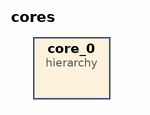
[diagram p0: block diagram of the top level]
# Vivado block design cores, xck26-sfvc784-2LV-c, Vivado 2025.2
create_bd_design cores

create_bd_cell -type hier core_0

# ---- hierarchy /core_0 ----
current_bd_instance /core_0
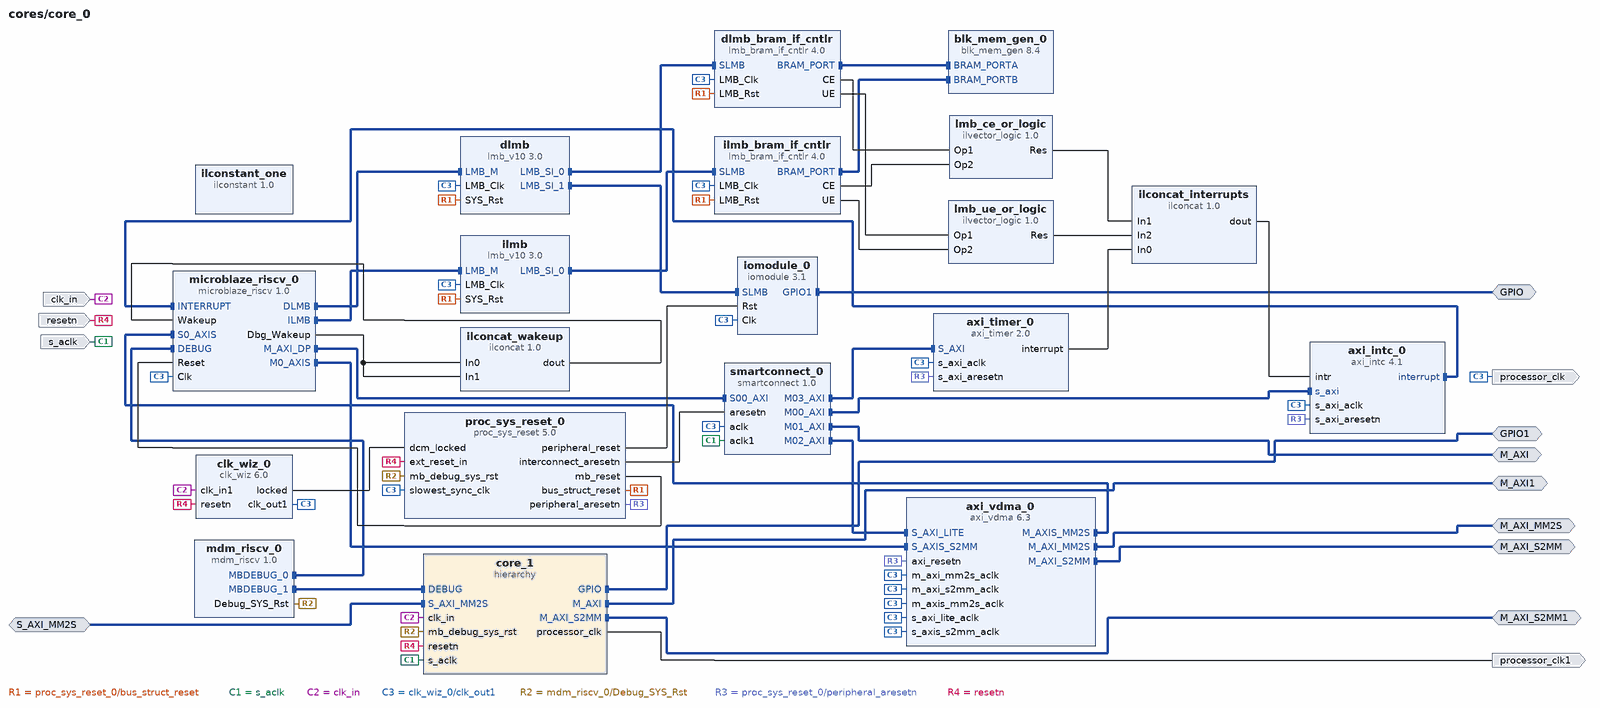
[diagram p1: block diagram inside /core_0]
create_bd_intf_pin -mode Master -vlnv xilinx.com:interface:aximm_rtl:1.0 M_AXI_S2MM
create_bd_intf_pin -mode Master -vlnv xilinx.com:interface:gpio_rtl:1.0 GPIO
create_bd_intf_pin -mode Master -vlnv xilinx.com:interface:aximm_rtl:1.0 M_AXI
create_bd_intf_pin -mode Master -vlnv xilinx.com:interface:aximm_rtl:1.0 M_AXI_MM2S
create_bd_intf_pin -mode Master -vlnv xilinx.com:interface:gpio_rtl:1.0 GPIO1
create_bd_intf_pin -mode Master -vlnv xilinx.com:interface:aximm_rtl:1.0 M_AXI1
create_bd_intf_pin -mode Slave -vlnv xilinx.com:interface:aximm_rtl:1.0 S_AXI_MM2S
create_bd_intf_pin -mode Master -vlnv xilinx.com:interface:aximm_rtl:1.0 M_AXI_S2MM1
create_bd_pin -dir I -type rst resetn
create_bd_pin -dir I -type clk clk_in
create_bd_pin -dir I -type clk s_aclk
create_bd_pin -dir O processor_clk
create_bd_pin -dir O processor_clk1

create_bd_cell -type ip -vlnv xilinx.com:ip:microblaze_riscv:1.0 microblaze_riscv_0
set_property -dict [list \
  CONFIG.C_BRANCH_TARGET_CACHE_SIZE 0 \
  CONFIG.C_DATA_SIZE 32 \
  CONFIG.C_DEBUG_EVENT_COUNTERS 2 \
  CONFIG.C_DEBUG_INTERFACE 0 \
  CONFIG.C_DEBUG_LATENCY_COUNTERS 2 \
  CONFIG.C_D_AXI 1 \
  CONFIG.C_ENABLE_DISCRETE_PORTS 1 \
  CONFIG.C_FSL_EXCEPTION 0 \
  CONFIG.C_FSL_LINKS 1 \
  CONFIG.C_ILL_INSTR_EXCEPTION 1 \
  CONFIG.C_I_AXI 0 \
  CONFIG.C_LOCKSTEP_SELECT 0 \
  CONFIG.C_MISALIGNED_EXCEPTIONS 0 \
  CONFIG.C_NUMBER_OF_PC_BRK 2 \
  CONFIG.C_NUMBER_OF_RD_ADDR_BRK 2 \
  CONFIG.C_NUMBER_OF_WR_ADDR_BRK 2 \
  CONFIG.C_OPTIMIZATION 0 \
  CONFIG.C_PMP_ENTRIES 0 \
  CONFIG.C_PMP_GRANULARITY 0 \
  CONFIG.C_TRACE 0 \
  CONFIG.C_USE_ATOMIC 0 \
  CONFIG.C_USE_BARREL 1 \
  CONFIG.C_USE_BITMAN_A 1 \
  CONFIG.C_USE_BITMAN_B 1 \
  CONFIG.C_USE_BITMAN_C 1 \
  CONFIG.C_USE_BITMAN_S 1 \
  CONFIG.C_USE_BRANCH_TARGET_CACHE 0 \
  CONFIG.C_USE_COMPRESSION 0 \
  CONFIG.C_USE_DCACHE 0 \
  CONFIG.C_USE_EXTENDED_FSL_INSTR 1 \
  CONFIG.C_USE_ICACHE 0 \
  CONFIG.C_USE_INTERRUPT 1 \
  CONFIG.C_USE_MMU 0 \
  CONFIG.C_USE_MULDIV 0 \
  CONFIG.G_TEMPLATE_LIST 4 \
] [get_bd_cells microblaze_riscv_0]
create_bd_cell -type ip -vlnv xilinx.com:ip:clk_wiz:6.0 clk_wiz_0
set_property -dict [list \
  CONFIG.CLKOUT1_DRIVES Buffer \
  CONFIG.CLKOUT1_JITTER 125.050 \
  CONFIG.CLKOUT1_MATCHED_ROUTING true \
  CONFIG.CLKOUT1_PHASE_ERROR 114.212 \
  CONFIG.CLKOUT1_REQUESTED_OUT_FREQ 200.000 \
  CONFIG.CLKOUT2_DRIVES Buffer \
  CONFIG.CLKOUT2_JITTER 142.903 \
  CONFIG.CLKOUT2_MATCHED_ROUTING true \
  CONFIG.CLKOUT2_PHASE_ERROR 114.212 \
  CONFIG.CLKOUT2_USED true \
  CONFIG.CLKOUT3_DRIVES Buffer \
  CONFIG.CLKOUT4_DRIVES Buffer \
  CONFIG.CLKOUT5_DRIVES Buffer \
  CONFIG.CLKOUT6_DRIVES Buffer \
  CONFIG.CLKOUT7_DRIVES Buffer \
  CONFIG.MMCM_BANDWIDTH OPTIMIZED \
  CONFIG.MMCM_CLKFBOUT_MULT_F 8 \
  CONFIG.MMCM_CLKOUT0_DIVIDE_F 4 \
  CONFIG.MMCM_CLKOUT1_DIVIDE 8 \
  CONFIG.MMCM_COMPENSATION AUTO \
  CONFIG.NUM_OUT_CLKS 2 \
  CONFIG.OPTIMIZE_CLOCKING_STRUCTURE_EN true \
  CONFIG.PRIMITIVE PLL \
  CONFIG.PRIM_SOURCE Global_buffer \
  CONFIG.RESET_PORT resetn \
  CONFIG.RESET_TYPE ACTIVE_LOW \
] [get_bd_cells clk_wiz_0]
create_bd_cell -type ip -vlnv xilinx.com:ip:proc_sys_reset:5.0 proc_sys_reset_0
create_bd_cell -type ip -vlnv xilinx.com:ip:axi_intc:4.1 axi_intc_0
set_property -dict [list \
  CONFIG.C_HAS_FAST 0 \
  CONFIG.C_PROCESSOR_CLK_FREQ_MHZ 200.0 \
  CONFIG.C_S_AXI_ACLK_FREQ_MHZ 200.0 \
] [get_bd_cells axi_intc_0]
create_bd_cell -type inline_hdl -vlnv xilinx.com:inline_hdl:ilconcat:1.0 ilconcat_wakeup
set_property -dict {CONFIG.NUM_PORTS 2} [get_bd_cells ilconcat_wakeup]
create_bd_cell -type ip -vlnv xilinx.com:ip:smartconnect:1.0 smartconnect_0
set_property -dict {CONFIG.NUM_CLKS 2 CONFIG.NUM_MI 4 CONFIG.NUM_SI 1} [get_bd_cells smartconnect_0]
create_bd_cell -type ip -vlnv xilinx.com:ip:lmb_v10:3.0 dlmb
set_property -dict {CONFIG.C_LMB_NUM_SLAVES 2} [get_bd_cells dlmb]
create_bd_cell -type ip -vlnv xilinx.com:ip:lmb_v10:3.0 ilmb
create_bd_cell -type ip -vlnv xilinx.com:ip:lmb_bram_if_cntlr:4.0 dlmb_bram_if_cntlr
set_property -dict {CONFIG.C_ECC 1} [get_bd_cells dlmb_bram_if_cntlr]
create_bd_cell -type ip -vlnv xilinx.com:ip:lmb_bram_if_cntlr:4.0 ilmb_bram_if_cntlr
set_property -dict {CONFIG.C_ECC 1} [get_bd_cells ilmb_bram_if_cntlr]
create_bd_cell -type ip -vlnv xilinx.com:ip:iomodule:3.1 iomodule_0
set_property -dict {CONFIG.C_GPO1_SIZE 2 CONFIG.C_USE_GPO1 1} [get_bd_cells iomodule_0]
create_bd_cell -type ip -vlnv xilinx.com:ip:blk_mem_gen:8.4 blk_mem_gen_0
set_property -dict [list \
  CONFIG.Assume_Synchronous_Clk true \
  CONFIG.Memory_Type True_Dual_Port_RAM \
  CONFIG.PRIM_type_to_Implement BRAM \
] [get_bd_cells blk_mem_gen_0]
create_bd_cell -type inline_hdl -vlnv xilinx.com:inline_hdl:ilvector_logic:1.0 lmb_ce_or_logic
set_property -dict {CONFIG.C_OPERATION or CONFIG.C_SIZE 1} [get_bd_cells lmb_ce_or_logic]
create_bd_cell -type inline_hdl -vlnv xilinx.com:inline_hdl:ilvector_logic:1.0 lmb_ue_or_logic
set_property -dict {CONFIG.C_OPERATION or CONFIG.C_SIZE 1} [get_bd_cells lmb_ue_or_logic]
create_bd_cell -type inline_hdl -vlnv xilinx.com:inline_hdl:ilconcat:1.0 ilconcat_interrupts
set_property -dict {CONFIG.NUM_PORTS 3} [get_bd_cells ilconcat_interrupts]
create_bd_cell -type ip -vlnv xilinx.com:ip:axi_vdma:6.3 axi_vdma_0
set_property -dict [list \
  CONFIG.c_enable_vert_flip 0 \
  CONFIG.c_include_mm2s 1 \
  CONFIG.c_include_s2mm 1 \
  CONFIG.c_m_axi_mm2s_data_width 1024 \
  CONFIG.c_m_axi_s2mm_data_width 1024 \
  CONFIG.c_m_axis_mm2s_tdata_width 32 \
  CONFIG.c_mm2s_linebuffer_depth 1024 \
  CONFIG.c_num_fstores 1 \
  CONFIG.c_s2mm_linebuffer_depth 1024 \
  CONFIG.c_s2mm_max_burst_length 2 \
  CONFIG.c_use_mm2s_fsync 0 \
] [get_bd_cells axi_vdma_0]
create_bd_cell -type ip -vlnv xilinx.com:ip:axi_timer:2.0 axi_timer_0
create_bd_cell -type hier core_1
create_bd_cell -type inline_hdl -vlnv xilinx.com:inline_hdl:ilconstant:1.0 ilconstant_one
create_bd_cell -type ip -vlnv xilinx.com:ip:mdm_riscv:1.0 mdm_riscv_0
set_property -dict {CONFIG.C_MB_DBG_PORTS 2} [get_bd_cells mdm_riscv_0]

# ---- hierarchy /core_0/core_1 ----
current_bd_instance /core_0/core_1
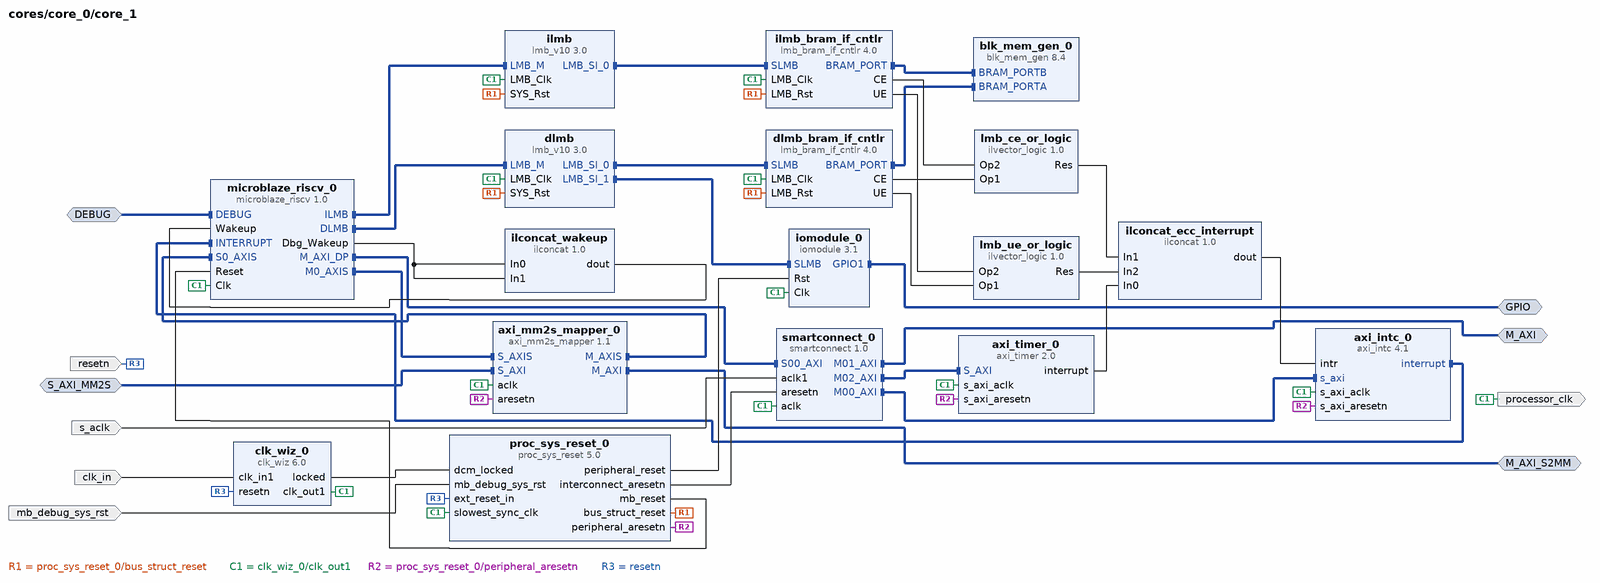
[diagram p2: block diagram inside /core_0/core_1]
create_bd_intf_pin -mode Slave -vlnv xilinx.com:interface:mbdebug_rtl:3.0 DEBUG
create_bd_intf_pin -mode Slave -vlnv xilinx.com:interface:aximm_rtl:1.0 S_AXI_MM2S
create_bd_intf_pin -mode Master -vlnv xilinx.com:interface:aximm_rtl:1.0 M_AXI_S2MM
create_bd_intf_pin -mode Master -vlnv xilinx.com:interface:gpio_rtl:1.0 GPIO
create_bd_intf_pin -mode Master -vlnv xilinx.com:interface:aximm_rtl:1.0 M_AXI
create_bd_pin -dir I -type rst resetn
create_bd_pin -dir I -type clk clk_in
create_bd_pin -dir I -type rst mb_debug_sys_rst
create_bd_pin -dir I -type clk s_aclk
create_bd_pin -dir O processor_clk

create_bd_cell -type ip -vlnv xilinx.com:ip:microblaze_riscv:1.0 microblaze_riscv_0
set_property -dict [list \
  CONFIG.C_BRANCH_TARGET_CACHE_SIZE 0 \
  CONFIG.C_DEBUG_EVENT_COUNTERS 2 \
  CONFIG.C_DEBUG_EXTERNAL_TRACE 0 \
  CONFIG.C_DEBUG_LATENCY_COUNTERS 2 \
  CONFIG.C_DP_AXI_MON 0 \
  CONFIG.C_D_AXI 1 \
  CONFIG.C_D_LMB_MON 0 \
  CONFIG.C_ENABLE_DISCRETE_PORTS 1 \
  CONFIG.C_FSL_LINKS 1 \
  CONFIG.C_HARTID 0x0000000000000001 \
  CONFIG.C_ILL_INSTR_EXCEPTION 1 \
  CONFIG.C_INTERRUPT_MON 1 \
  CONFIG.C_I_AXI 0 \
  CONFIG.C_I_LMB_MON 0 \
  CONFIG.C_LOCKSTEP_SELECT 0 \
  CONFIG.C_MISALIGNED_EXCEPTIONS 0 \
  CONFIG.C_NUMBER_OF_PC_BRK 2 \
  CONFIG.C_NUMBER_OF_RD_ADDR_BRK 2 \
  CONFIG.C_NUMBER_OF_WR_ADDR_BRK 2 \
  CONFIG.C_PMP_ENTRIES 0 \
  CONFIG.C_PMP_GRANULARITY 0 \
  CONFIG.C_TRACE 0 \
  CONFIG.C_USE_ATOMIC 0 \
  CONFIG.C_USE_BARREL 1 \
  CONFIG.C_USE_BITMAN_A 1 \
  CONFIG.C_USE_BITMAN_B 1 \
  CONFIG.C_USE_BITMAN_C 1 \
  CONFIG.C_USE_BITMAN_S 1 \
  CONFIG.C_USE_BRANCH_TARGET_CACHE 0 \
  CONFIG.C_USE_COMPRESSION 0 \
  CONFIG.C_USE_INTERRUPT 1 \
  CONFIG.C_USE_MULDIV 0 \
  CONFIG.G_TEMPLATE_LIST 4 \
] [get_bd_cells microblaze_riscv_0]
create_bd_cell -type ip -vlnv xilinx.com:ip:clk_wiz:6.0 clk_wiz_0
set_property -dict [list \
  CONFIG.CLKOUT1_DRIVES Buffer \
  CONFIG.CLKOUT1_JITTER 125.050 \
  CONFIG.CLKOUT1_PHASE_ERROR 114.212 \
  CONFIG.CLKOUT1_REQUESTED_OUT_FREQ 200.000 \
  CONFIG.CLKOUT2_DRIVES Buffer \
  CONFIG.CLKOUT3_DRIVES Buffer \
  CONFIG.CLKOUT4_DRIVES Buffer \
  CONFIG.CLKOUT5_DRIVES Buffer \
  CONFIG.CLKOUT6_DRIVES Buffer \
  CONFIG.CLKOUT7_DRIVES Buffer \
  CONFIG.MMCM_BANDWIDTH OPTIMIZED \
  CONFIG.MMCM_CLKFBOUT_MULT_F 8 \
  CONFIG.MMCM_CLKOUT0_DIVIDE_F 4 \
  CONFIG.MMCM_COMPENSATION AUTO \
  CONFIG.OPTIMIZE_CLOCKING_STRUCTURE_EN true \
  CONFIG.PRIMITIVE PLL \
  CONFIG.PRIM_SOURCE Global_buffer \
  CONFIG.RESET_PORT resetn \
  CONFIG.RESET_TYPE ACTIVE_LOW \
] [get_bd_cells clk_wiz_0]
create_bd_cell -type ip -vlnv xilinx.com:ip:proc_sys_reset:5.0 proc_sys_reset_0
create_bd_cell -type ip -vlnv xilinx.com:ip:axi_intc:4.1 axi_intc_0
set_property -dict [list \
  CONFIG.C_HAS_FAST 0 \
  CONFIG.C_PROCESSOR_CLK_FREQ_MHZ 200.0 \
  CONFIG.C_S_AXI_ACLK_FREQ_MHZ 200.0 \
] [get_bd_cells axi_intc_0]
create_bd_cell -type inline_hdl -vlnv xilinx.com:inline_hdl:ilconcat:1.0 ilconcat_wakeup
create_bd_cell -type ip -vlnv xilinx.com:ip:axi_mm2s_mapper:1.1 axi_mm2s_mapper_0
set_property -dict {CONFIG.DATA_WIDTH 1024 CONFIG.TDATA_NUM_BYTES 4} [get_bd_cells axi_mm2s_mapper_0]
create_bd_cell -type ip -vlnv xilinx.com:ip:smartconnect:1.0 smartconnect_0
set_property -dict {CONFIG.NUM_CLKS 2 CONFIG.NUM_MI 3 CONFIG.NUM_SI 1} [get_bd_cells smartconnect_0]
create_bd_cell -type ip -vlnv xilinx.com:ip:lmb_v10:3.0 dlmb
set_property -dict {CONFIG.C_LMB_NUM_SLAVES 2} [get_bd_cells dlmb]
create_bd_cell -type ip -vlnv xilinx.com:ip:lmb_bram_if_cntlr:4.0 ilmb_bram_if_cntlr
set_property -dict {CONFIG.C_ECC 1} [get_bd_cells ilmb_bram_if_cntlr]
create_bd_cell -type ip -vlnv xilinx.com:ip:iomodule:3.1 iomodule_0
set_property -dict {CONFIG.C_GPO1_SIZE 2 CONFIG.C_USE_GPO1 1} [get_bd_cells iomodule_0]
create_bd_cell -type ip -vlnv xilinx.com:ip:blk_mem_gen:8.4 blk_mem_gen_0
set_property -dict [list \
  CONFIG.Assume_Synchronous_Clk true \
  CONFIG.Memory_Type True_Dual_Port_RAM \
  CONFIG.PRIM_type_to_Implement BRAM \
] [get_bd_cells blk_mem_gen_0]
create_bd_cell -type inline_hdl -vlnv xilinx.com:inline_hdl:ilvector_logic:1.0 lmb_ce_or_logic
set_property -dict {CONFIG.C_OPERATION or CONFIG.C_SIZE 1} [get_bd_cells lmb_ce_or_logic]
create_bd_cell -type inline_hdl -vlnv xilinx.com:inline_hdl:ilvector_logic:1.0 lmb_ue_or_logic
set_property -dict {CONFIG.C_OPERATION or CONFIG.C_SIZE 1} [get_bd_cells lmb_ue_or_logic]
create_bd_cell -type inline_hdl -vlnv xilinx.com:inline_hdl:ilconcat:1.0 ilconcat_ecc_interrupt
set_property -dict {CONFIG.NUM_PORTS 3} [get_bd_cells ilconcat_ecc_interrupt]
create_bd_cell -type ip -vlnv xilinx.com:ip:axi_timer:2.0 axi_timer_0
create_bd_cell -type ip -vlnv xilinx.com:ip:lmb_v10:3.0 ilmb
create_bd_cell -type ip -vlnv xilinx.com:ip:lmb_bram_if_cntlr:4.0 dlmb_bram_if_cntlr
set_property -dict {CONFIG.C_ECC 1} [get_bd_cells dlmb_bram_if_cntlr]

# ---- connections ----

current_bd_instance /core_0
connect_bd_intf_net [get_bd_intf_pins dlmb_bram_if_cntlr/SLMB] [get_bd_intf_pins dlmb/LMB_Sl_0]
connect_bd_intf_net [get_bd_intf_pins core_1/GPIO] [get_bd_intf_pins GPIO1]
connect_bd_intf_net [get_bd_intf_pins ilmb_bram_if_cntlr/SLMB] [get_bd_intf_pins ilmb/LMB_Sl_0]
connect_bd_intf_net [get_bd_intf_pins iomodule_0/SLMB] [get_bd_intf_pins dlmb/LMB_Sl_1]
connect_bd_intf_net [get_bd_intf_pins iomodule_0/GPIO1] [get_bd_intf_pins GPIO]
connect_bd_intf_net [get_bd_intf_pins smartconnect_0/M01_AXI] [get_bd_intf_pins M_AXI]
connect_bd_intf_net [get_bd_intf_pins core_1/M_AXI] [get_bd_intf_pins M_AXI1]
connect_bd_intf_net [get_bd_intf_pins core_1/S_AXI_MM2S] [get_bd_intf_pins S_AXI_MM2S]
connect_bd_intf_net [get_bd_intf_pins core_1/M_AXI_S2MM] [get_bd_intf_pins M_AXI_S2MM1]
connect_bd_intf_net [get_bd_intf_pins core_1/DEBUG] [get_bd_intf_pins mdm_riscv_0/MBDEBUG_1]
connect_bd_intf_net [get_bd_intf_pins axi_intc_0/interrupt] [get_bd_intf_pins microblaze_riscv_0/INTERRUPT]
connect_bd_intf_net [get_bd_intf_pins axi_vdma_0/M_AXIS_MM2S] [get_bd_intf_pins microblaze_riscv_0/S0_AXIS]
connect_bd_intf_net [get_bd_intf_pins M_AXI_MM2S] [get_bd_intf_pins axi_vdma_0/M_AXI_MM2S]
connect_bd_intf_net [get_bd_intf_pins M_AXI_S2MM] [get_bd_intf_pins axi_vdma_0/M_AXI_S2MM]
connect_bd_intf_net [get_bd_intf_pins blk_mem_gen_0/BRAM_PORTA] [get_bd_intf_pins dlmb_bram_if_cntlr/BRAM_PORT]
connect_bd_intf_net [get_bd_intf_pins blk_mem_gen_0/BRAM_PORTB] [get_bd_intf_pins ilmb_bram_if_cntlr/BRAM_PORT]
connect_bd_intf_net [get_bd_intf_pins microblaze_riscv_0/DEBUG] [get_bd_intf_pins mdm_riscv_0/MBDEBUG_0]
connect_bd_intf_net [get_bd_intf_pins dlmb/LMB_M] [get_bd_intf_pins microblaze_riscv_0/DLMB]
connect_bd_intf_net [get_bd_intf_pins ilmb/LMB_M] [get_bd_intf_pins microblaze_riscv_0/ILMB]
connect_bd_intf_net [get_bd_intf_pins axi_vdma_0/S_AXIS_S2MM] [get_bd_intf_pins microblaze_riscv_0/M0_AXIS]
connect_bd_intf_net [get_bd_intf_pins smartconnect_0/S00_AXI] [get_bd_intf_pins microblaze_riscv_0/M_AXI_DP]
connect_bd_intf_net [get_bd_intf_pins smartconnect_0/M00_AXI] [get_bd_intf_pins axi_intc_0/s_axi]
connect_bd_intf_net [get_bd_intf_pins smartconnect_0/M02_AXI] [get_bd_intf_pins axi_vdma_0/S_AXI_LITE]
connect_bd_intf_net [get_bd_intf_pins axi_timer_0/S_AXI] [get_bd_intf_pins smartconnect_0/M03_AXI]
connect_bd_net [get_bd_pins microblaze_riscv_0/Dbg_Wakeup] [get_bd_pins ilconcat_wakeup/In0] [get_bd_pins ilconcat_wakeup/In1]
connect_bd_net [get_bd_pins proc_sys_reset_0/bus_struct_reset] \
  [get_bd_pins ilmb/SYS_Rst] [get_bd_pins dlmb/SYS_Rst] [get_bd_pins dlmb_bram_if_cntlr/LMB_Rst] \
  [get_bd_pins ilmb_bram_if_cntlr/LMB_Rst]
connect_bd_net -net aclk1_0_1 [get_bd_pins s_aclk] [get_bd_pins smartconnect_0/aclk1] [get_bd_pins core_1/s_aclk]
connect_bd_net [get_bd_pins axi_timer_0/interrupt] [get_bd_pins ilconcat_interrupts/In0]
connect_bd_net -net clk_in1_0_1 [get_bd_pins clk_in] [get_bd_pins clk_wiz_0/clk_in1] [get_bd_pins core_1/clk_in]
connect_bd_net [get_bd_pins clk_wiz_0/clk_out1] \
  [get_bd_pins microblaze_riscv_0/Clk] [get_bd_pins proc_sys_reset_0/slowest_sync_clk] [get_bd_pins axi_intc_0/s_axi_aclk] \
  [get_bd_pins smartconnect_0/aclk] [get_bd_pins ilmb/LMB_Clk] [get_bd_pins dlmb/LMB_Clk] \
  [get_bd_pins dlmb_bram_if_cntlr/LMB_Clk] [get_bd_pins ilmb_bram_if_cntlr/LMB_Clk] [get_bd_pins iomodule_0/Clk] \
  [get_bd_pins processor_clk] [get_bd_pins axi_vdma_0/s_axi_lite_aclk] [get_bd_pins axi_vdma_0/m_axi_mm2s_aclk] \
  [get_bd_pins axi_vdma_0/m_axis_mm2s_aclk] [get_bd_pins axi_vdma_0/m_axi_s2mm_aclk] \
  [get_bd_pins axi_vdma_0/s_axis_s2mm_aclk] [get_bd_pins axi_timer_0/s_axi_aclk]
connect_bd_net [get_bd_pins clk_wiz_0/locked] [get_bd_pins proc_sys_reset_0/dcm_locked]
connect_bd_net [get_bd_pins core_1/processor_clk] [get_bd_pins processor_clk1]
connect_bd_net [get_bd_pins dlmb_bram_if_cntlr/CE] [get_bd_pins lmb_ce_or_logic/Op1]
connect_bd_net [get_bd_pins dlmb_bram_if_cntlr/UE] [get_bd_pins lmb_ue_or_logic/Op1]
connect_bd_net -net ilconcat_0_dout [get_bd_pins ilconcat_wakeup/dout] [get_bd_pins microblaze_riscv_0/Wakeup]
connect_bd_net -net ilconcat_ecc_interrupt_dout [get_bd_pins ilconcat_interrupts/dout] [get_bd_pins axi_intc_0/intr]
connect_bd_net [get_bd_pins ilmb_bram_if_cntlr/CE] [get_bd_pins lmb_ce_or_logic/Op2]
connect_bd_net [get_bd_pins ilmb_bram_if_cntlr/UE] [get_bd_pins lmb_ue_or_logic/Op2]
connect_bd_net [get_bd_pins lmb_ce_or_logic/Res] [get_bd_pins ilconcat_interrupts/In1]
connect_bd_net [get_bd_pins lmb_ue_or_logic/Res] [get_bd_pins ilconcat_interrupts/In2]
connect_bd_net -net mb_debug_sys_rst_0_1 [get_bd_pins mdm_riscv_0/Debug_SYS_Rst] \
  [get_bd_pins proc_sys_reset_0/mb_debug_sys_rst] [get_bd_pins core_1/mb_debug_sys_rst]
connect_bd_net [get_bd_pins proc_sys_reset_0/interconnect_aresetn] [get_bd_pins smartconnect_0/aresetn]
connect_bd_net [get_bd_pins proc_sys_reset_0/mb_reset] [get_bd_pins microblaze_riscv_0/Reset]
connect_bd_net [get_bd_pins proc_sys_reset_0/peripheral_aresetn] \
  [get_bd_pins axi_intc_0/s_axi_aresetn] [get_bd_pins axi_vdma_0/axi_resetn] [get_bd_pins axi_timer_0/s_axi_aresetn]
connect_bd_net [get_bd_pins proc_sys_reset_0/peripheral_reset] [get_bd_pins iomodule_0/Rst]
connect_bd_net -net resetn_0_1 [get_bd_pins resetn] \
  [get_bd_pins clk_wiz_0/resetn] [get_bd_pins proc_sys_reset_0/ext_reset_in] [get_bd_pins core_1/resetn]
set_property HDL_ATTRIBUTE.BMM_INFO_PROCESSOR {riscv > design_top core_0/dlmb_bram_if_cntlr} [get_bd_cells microblaze_riscv_0]
set_property HDL_ATTRIBUTE.KEEP_HIERARCHY yes [get_bd_cells microblaze_riscv_0]
set_property HDL_ATTRIBUTE.BMM_INFO_ADDRESS_SPACE {byte  0xF4000000 40 > design_top core_0/blk_mem_gen_0} [get_bd_cells dlmb_bram_if_cntlr]
set_property HDL_ATTRIBUTE.KEEP_HIERARCHY yes [get_bd_cells dlmb_bram_if_cntlr]

current_bd_instance /core_0/core_1
connect_bd_intf_net [get_bd_intf_pins dlmb/LMB_Sl_0] [get_bd_intf_pins dlmb_bram_if_cntlr/SLMB]
connect_bd_intf_net [get_bd_intf_pins axi_mm2s_mapper_0/S_AXI] [get_bd_intf_pins S_AXI_MM2S]
connect_bd_intf_net [get_bd_intf_pins axi_mm2s_mapper_0/M_AXI] [get_bd_intf_pins M_AXI_S2MM]
connect_bd_intf_net [get_bd_intf_pins ilmb_bram_if_cntlr/SLMB] [get_bd_intf_pins ilmb/LMB_Sl_0]
connect_bd_intf_net [get_bd_intf_pins iomodule_0/SLMB] [get_bd_intf_pins dlmb/LMB_Sl_1]
connect_bd_intf_net [get_bd_intf_pins iomodule_0/GPIO1] [get_bd_intf_pins GPIO]
connect_bd_intf_net [get_bd_intf_pins smartconnect_0/M01_AXI] [get_bd_intf_pins M_AXI]
connect_bd_intf_net [get_bd_intf_pins DEBUG] [get_bd_intf_pins microblaze_riscv_0/DEBUG]
connect_bd_intf_net [get_bd_intf_pins axi_intc_0/interrupt] [get_bd_intf_pins microblaze_riscv_0/INTERRUPT]
connect_bd_intf_net [get_bd_intf_pins microblaze_riscv_0/S0_AXIS] [get_bd_intf_pins axi_mm2s_mapper_0/M_AXIS]
connect_bd_intf_net [get_bd_intf_pins blk_mem_gen_0/BRAM_PORTA] [get_bd_intf_pins dlmb_bram_if_cntlr/BRAM_PORT]
connect_bd_intf_net [get_bd_intf_pins blk_mem_gen_0/BRAM_PORTB] [get_bd_intf_pins ilmb_bram_if_cntlr/BRAM_PORT]
connect_bd_intf_net [get_bd_intf_pins dlmb/LMB_M] [get_bd_intf_pins microblaze_riscv_0/DLMB]
connect_bd_intf_net [get_bd_intf_pins microblaze_riscv_0/ILMB] [get_bd_intf_pins ilmb/LMB_M]
connect_bd_intf_net [get_bd_intf_pins microblaze_riscv_0/M0_AXIS] [get_bd_intf_pins axi_mm2s_mapper_0/S_AXIS]
connect_bd_intf_net [get_bd_intf_pins microblaze_riscv_0/M_AXI_DP] [get_bd_intf_pins smartconnect_0/S00_AXI]
connect_bd_intf_net [get_bd_intf_pins smartconnect_0/M00_AXI] [get_bd_intf_pins axi_intc_0/s_axi]
connect_bd_intf_net [get_bd_intf_pins smartconnect_0/M02_AXI] [get_bd_intf_pins axi_timer_0/S_AXI]
connect_bd_net [get_bd_pins microblaze_riscv_0/Dbg_Wakeup] [get_bd_pins ilconcat_wakeup/In0] [get_bd_pins ilconcat_wakeup/In1]
connect_bd_net [get_bd_pins proc_sys_reset_0/bus_struct_reset] \
  [get_bd_pins dlmb/SYS_Rst] [get_bd_pins ilmb_bram_if_cntlr/LMB_Rst] [get_bd_pins ilmb/SYS_Rst] \
  [get_bd_pins dlmb_bram_if_cntlr/LMB_Rst]
connect_bd_net -net aclk1_0_1 [get_bd_pins s_aclk] [get_bd_pins smartconnect_0/aclk1]
connect_bd_net [get_bd_pins axi_timer_0/interrupt] [get_bd_pins ilconcat_ecc_interrupt/In0]
connect_bd_net -net clk_in1_0_1 [get_bd_pins clk_in] [get_bd_pins clk_wiz_0/clk_in1]
connect_bd_net [get_bd_pins clk_wiz_0/clk_out1] \
  [get_bd_pins microblaze_riscv_0/Clk] [get_bd_pins proc_sys_reset_0/slowest_sync_clk] [get_bd_pins axi_intc_0/s_axi_aclk] \
  [get_bd_pins axi_mm2s_mapper_0/aclk] [get_bd_pins smartconnect_0/aclk] [get_bd_pins dlmb/LMB_Clk] \
  [get_bd_pins ilmb_bram_if_cntlr/LMB_Clk] [get_bd_pins iomodule_0/Clk] [get_bd_pins processor_clk] \
  [get_bd_pins axi_timer_0/s_axi_aclk] [get_bd_pins ilmb/LMB_Clk] [get_bd_pins dlmb_bram_if_cntlr/LMB_Clk]
connect_bd_net [get_bd_pins clk_wiz_0/locked] [get_bd_pins proc_sys_reset_0/dcm_locked]
connect_bd_net [get_bd_pins dlmb_bram_if_cntlr/CE] [get_bd_pins lmb_ce_or_logic/Op1]
connect_bd_net [get_bd_pins dlmb_bram_if_cntlr/UE] [get_bd_pins lmb_ue_or_logic/Op1]
connect_bd_net -net ilconcat_0_dout [get_bd_pins ilconcat_wakeup/dout] [get_bd_pins microblaze_riscv_0/Wakeup]
connect_bd_net [get_bd_pins ilconcat_ecc_interrupt/dout] [get_bd_pins axi_intc_0/intr]
connect_bd_net [get_bd_pins ilmb_bram_if_cntlr/CE] [get_bd_pins lmb_ce_or_logic/Op2]
connect_bd_net [get_bd_pins ilmb_bram_if_cntlr/UE] [get_bd_pins lmb_ue_or_logic/Op2]
connect_bd_net [get_bd_pins lmb_ce_or_logic/Res] [get_bd_pins ilconcat_ecc_interrupt/In1]
connect_bd_net [get_bd_pins lmb_ue_or_logic/Res] [get_bd_pins ilconcat_ecc_interrupt/In2]
connect_bd_net -net mb_debug_sys_rst_0_1 [get_bd_pins mb_debug_sys_rst] [get_bd_pins proc_sys_reset_0/mb_debug_sys_rst]
connect_bd_net [get_bd_pins proc_sys_reset_0/interconnect_aresetn] [get_bd_pins smartconnect_0/aresetn]
connect_bd_net [get_bd_pins proc_sys_reset_0/mb_reset] [get_bd_pins microblaze_riscv_0/Reset]
connect_bd_net [get_bd_pins proc_sys_reset_0/peripheral_aresetn] \
  [get_bd_pins axi_intc_0/s_axi_aresetn] [get_bd_pins axi_mm2s_mapper_0/aresetn] [get_bd_pins axi_timer_0/s_axi_aresetn]
connect_bd_net [get_bd_pins proc_sys_reset_0/peripheral_reset] [get_bd_pins iomodule_0/Rst]
connect_bd_net -net resetn_0_1 [get_bd_pins resetn] [get_bd_pins clk_wiz_0/resetn] [get_bd_pins proc_sys_reset_0/ext_reset_in]
set_property HDL_ATTRIBUTE.BMM_INFO_PROCESSOR {riscv > design_top core_0/core_1/dlmb_bram_if_cntlr} [get_bd_cells microblaze_riscv_0]
set_property HDL_ATTRIBUTE.KEEP_HIERARCHY yes [get_bd_cells microblaze_riscv_0]
set_property HDL_ATTRIBUTE.BMM_INFO_ADDRESS_SPACE {byte  0x80000000 40 > design_top core_0/core_1/blk_mem_gen_0} [get_bd_cells ilmb_bram_if_cntlr]
set_property HDL_ATTRIBUTE.KEEP_HIERARCHY yes [get_bd_cells ilmb_bram_if_cntlr]
set_property HDL_ATTRIBUTE.BMM_INFO_ADDRESS_SPACE {byte  0xF4000000 40 > design_top core_0/core_1/blk_mem_gen_0} [get_bd_cells dlmb_bram_if_cntlr]
set_property HDL_ATTRIBUTE.KEEP_HIERARCHY yes [get_bd_cells dlmb_bram_if_cntlr]

# ---- address map ----
assign_bd_address -offset 0xF0000000 -range 1K -target_address_space [get_bd_addr_spaces core_0/core_1/microblaze_riscv_0/Data] [get_bd_addr_segs core_0/core_1/axi_intc_0/S_AXI/Reg]
assign_bd_address -offset 0xF1000000 -range 128 -target_address_space [get_bd_addr_spaces core_0/core_1/microblaze_riscv_0/Data] [get_bd_addr_segs core_0/core_1/axi_timer_0/S_AXI/Reg]
assign_bd_address -offset 0xF3000000 -range 4K -target_address_space [get_bd_addr_spaces core_0/core_1/microblaze_riscv_0/Data] [get_bd_addr_segs core_0/core_1/iomodule_0/SLMB/Reg]
assign_bd_address -offset 0xF4000000 -range 8K -target_address_space [get_bd_addr_spaces core_0/core_1/microblaze_riscv_0/Data] [get_bd_addr_segs core_0/core_1/dlmb_bram_if_cntlr/SLMB/Mem]
assign_bd_address -offset 0xF4000000 -range 8K -target_address_space [get_bd_addr_spaces core_0/core_1/microblaze_riscv_0/Instruction] [get_bd_addr_segs core_0/core_1/ilmb_bram_if_cntlr/SLMB/Mem]
assign_bd_address -offset 0xF0000000 -range 1K -target_address_space [get_bd_addr_spaces core_0/microblaze_riscv_0/Data] [get_bd_addr_segs core_0/axi_intc_0/S_AXI/Reg]
assign_bd_address -offset 0xF1000000 -range 128 -target_address_space [get_bd_addr_spaces core_0/microblaze_riscv_0/Data] [get_bd_addr_segs core_0/axi_timer_0/S_AXI/Reg]
assign_bd_address -offset 0xF2000000 -range 64K -target_address_space [get_bd_addr_spaces core_0/microblaze_riscv_0/Data] [get_bd_addr_segs core_0/axi_vdma_0/S_AXI_LITE/Reg]
assign_bd_address -offset 0xF3000000 -range 4K -target_address_space [get_bd_addr_spaces core_0/microblaze_riscv_0/Data] [get_bd_addr_segs core_0/iomodule_0/SLMB/Reg]
assign_bd_address -offset 0xF4000000 -range 8K -target_address_space [get_bd_addr_spaces core_0/microblaze_riscv_0/Data] [get_bd_addr_segs core_0/dlmb_bram_if_cntlr/SLMB/Mem]
assign_bd_address -offset 0xF4000000 -range 8K -target_address_space [get_bd_addr_spaces core_0/microblaze_riscv_0/Instruction] [get_bd_addr_segs core_0/ilmb_bram_if_cntlr/SLMB/Mem]

validate_bd_design
save_bd_design
